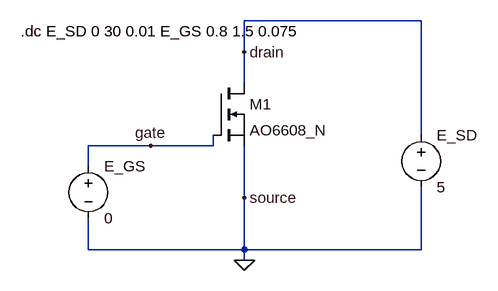
[diagram p0: schematic Draft1.asc]
Draft1.asc, the LTspice schematic file:
Version 4
SHEET 1 880 680
WIRE 480 32 208 32
WIRE 208 80 208 32
WIRE 208 128 208 80
WIRE 480 208 480 32
WIRE 64 224 -32 224
WIRE 160 224 160 208
WIRE 160 224 64 224
WIRE -32 256 -32 224
WIRE 208 304 208 224
WIRE -32 384 -32 336
WIRE 208 384 208 304
WIRE 208 384 -32 384
WIRE 480 384 480 288
WIRE 480 384 208 384
WIRE 208 400 208 384
FLAG 208 400 0
FLAG 208 304 source
FLAG 208 80 drain
FLAG 64 224 gate
SYMBOL nmos 160 128 R0
SYMATTR InstName M1
SYMATTR Value AO6608_N
SYMBOL voltage 480 192 R0
WINDOW 123 0 0 Left 0
WINDOW 39 0 0 Left 0
SYMATTR InstName E_SD
SYMATTR Value 5
SYMBOL voltage -32 240 R0
SYMATTR InstName E_GS
SYMATTR Value 0
TEXT -136 48 Left 2 !.dc E_SD 0 30 0.01 E_GS 0.8 1.5 0.075

The netlist it stands for:
* Draft1.asc
M1 drain gate 0 0 AO6608_N
V§E_SD drain 0 5
V§E_GS gate 0 0
.model NMOS NMOS
.model PMOS PMOS
.lib standard.mos
.dc E_SD 0 30 0.01 E_GS 0.8 1.5 0.075
.backanno
.end